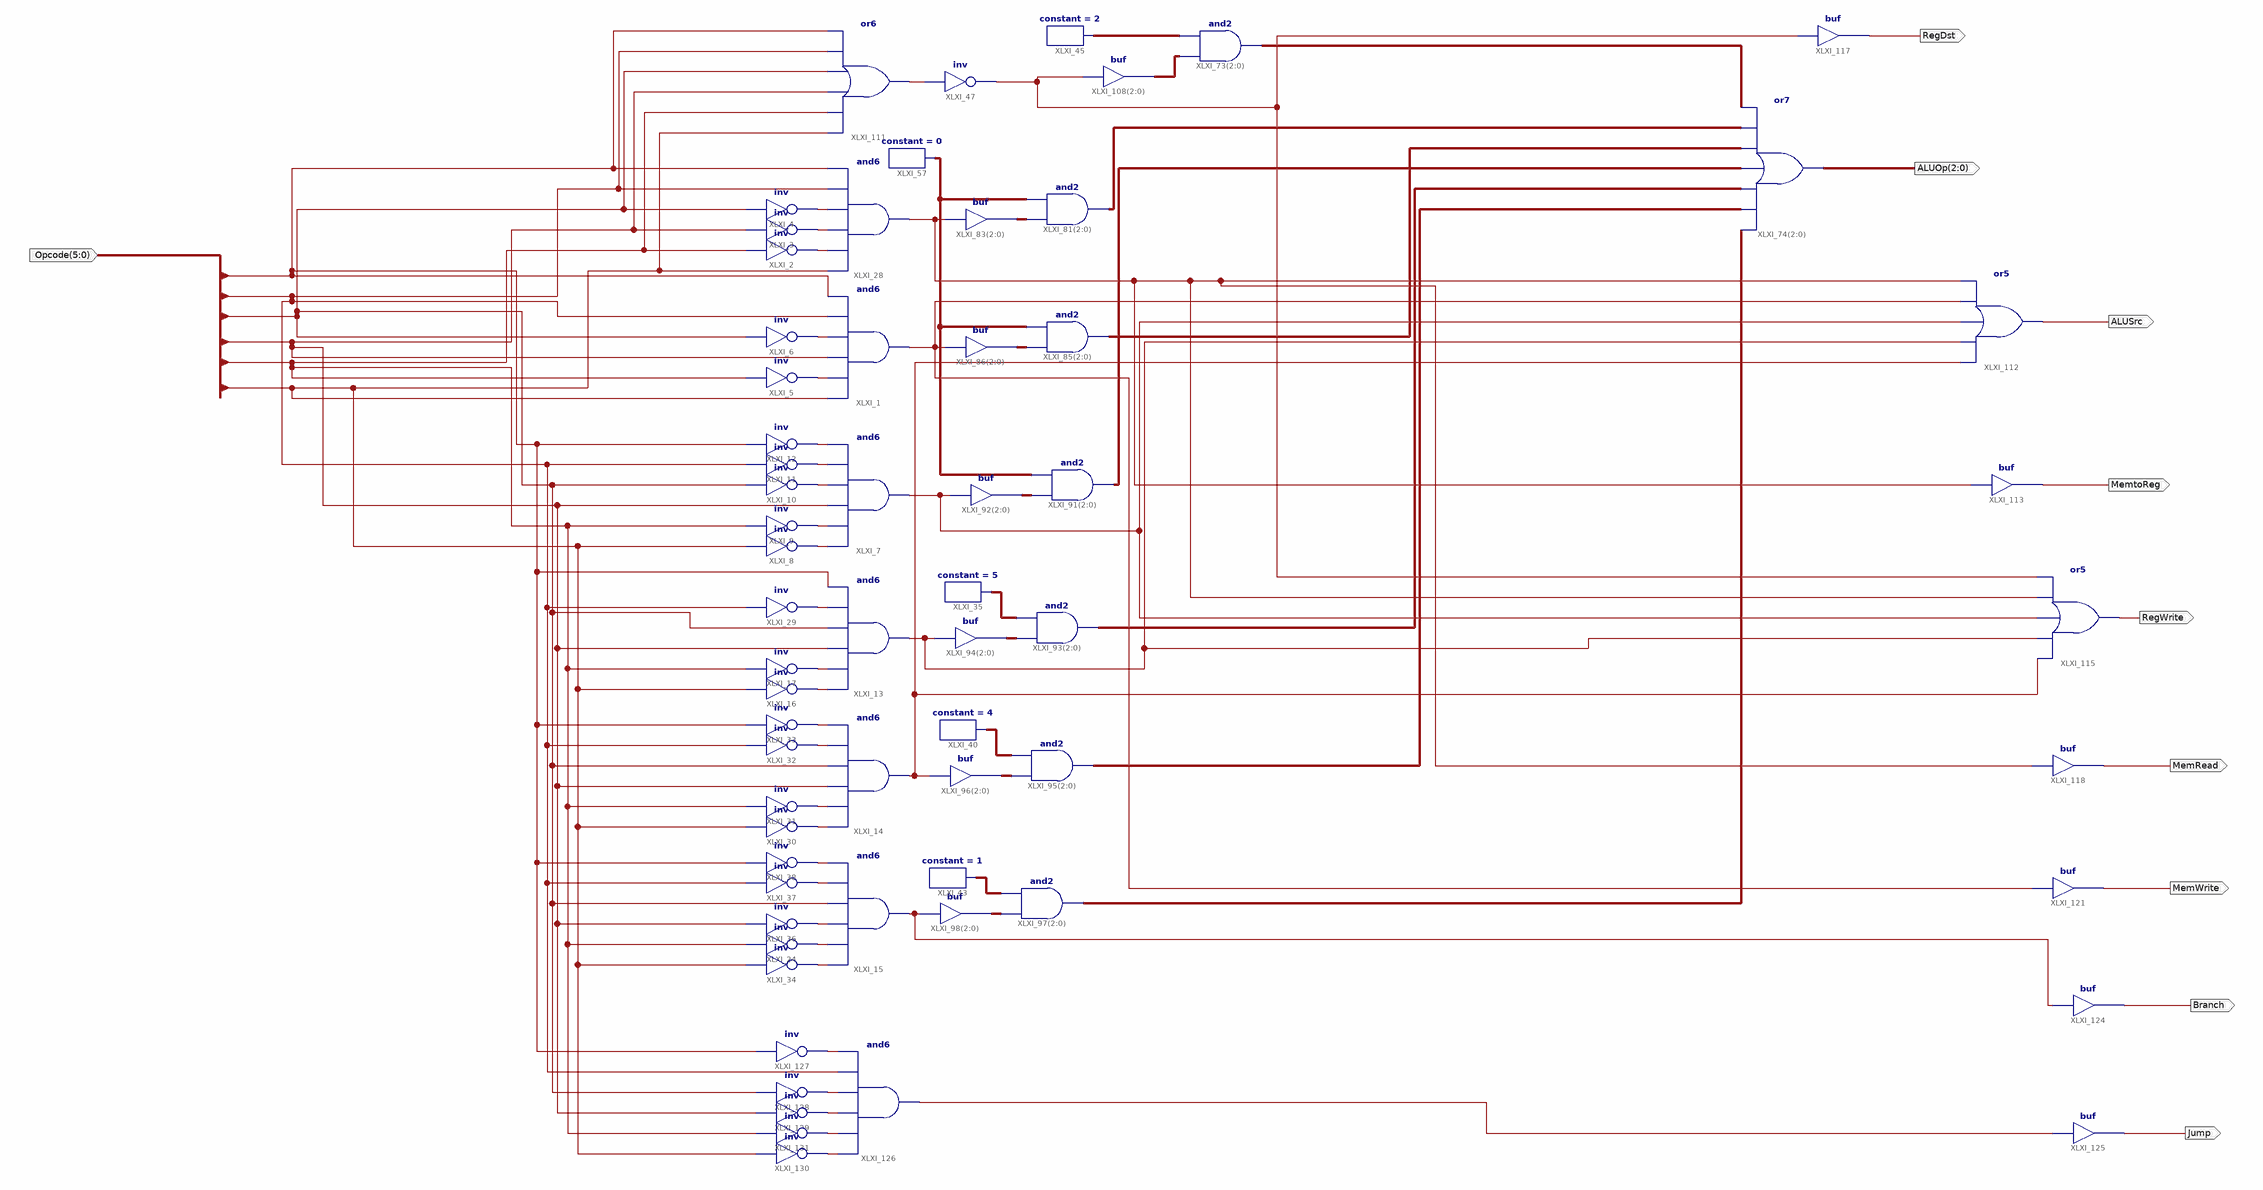
[diagram p0: schematic sheet 1]
// Xilinx ISE schematic control.sch (spartan3) as structural Verilog: 64 symbols, 10 ports
module control (
  input  [5:0] Opcode,
  output [2:0] ALUOp,
  output ALUSrc,
  output MemtoReg,
  output RegWrite,
  output RegDst,
  output MemRead,
  output MemWrite,
  output Branch,
  output Jump
);

  wire XLXN_12, XLXN_13, XLXN_14, XLXN_15, XLXN_16, XLXN_17, XLXN_18, XLXN_19, XLXN_20, XLXN_21, XLXN_22,
       XLXN_23, XLXN_24, XLXN_25, XLXN_26, XLXN_27, XLXN_28, XLXN_29, XLXN_30, XLXN_31, XLXN_32, XLXN_35,
       XLXN_36, XLXN_105, XLXN_110, XLXN_155, XLXN_161, XLXN_163, XLXN_170, XLXN_176, XLXN_180, XLXN_181,
       XLXN_182, XLXN_183, XLXN_184, XLXN_192;
  wire [2:0] XLXN_89, XLXN_93, XLXN_94, XLXN_96, XLXN_104, XLXN_106, XLXN_107, XLXN_108, XLXN_109, XLXN_111,
       XLXN_112, XLXN_113, XLXN_115, XLXN_116, XLXN_117, XLXN_119, XLXN_120, XLXN_135, XLXN_178;

  and XLXI_1 (XLXN_155, Opcode[5], XLXN_14, Opcode[3], XLXN_15, Opcode[1], Opcode[0]);
  not XLXI_2 (XLXN_13, Opcode[4]);
  not XLXI_3 (XLXN_12, Opcode[3]);
  not XLXI_4 (XLXN_22, Opcode[2]);
  not XLXI_5 (XLXN_14, Opcode[4]);
  not XLXI_6 (XLXN_15, Opcode[2]);
  and XLXI_7 (XLXN_105, XLXN_16, XLXN_17, Opcode[3], XLXN_18, XLXN_19, XLXN_20);
  not XLXI_8 (XLXN_16, Opcode[5]);
  not XLXI_9 (XLXN_17, Opcode[4]);
  not XLXI_10 (XLXN_18, Opcode[2]);
  not XLXI_11 (XLXN_19, Opcode[1]);
  not XLXI_12 (XLXN_20, Opcode[0]);
  and XLXI_13 (XLXN_110, XLXN_21, XLXN_24, Opcode[3], Opcode[2], XLXN_23, Opcode[0]);
  and XLXI_14 (XLXN_170, XLXN_26, XLXN_25, Opcode[3], Opcode[2], XLXN_28, XLXN_27);
  and XLXI_15 (XLXN_176, XLXN_30, XLXN_29, XLXN_32, Opcode[2], XLXN_31, XLXN_36);
  not XLXI_16 (XLXN_21, Opcode[5]);
  not XLXI_17 (XLXN_24, Opcode[4]);
  not XLXI_29 (XLXN_23, Opcode[1]);
  not XLXI_30 (XLXN_26, Opcode[5]);
  not XLXI_31 (XLXN_25, Opcode[4]);
  not XLXI_32 (XLXN_28, Opcode[1]);
  not XLXI_33 (XLXN_27, Opcode[0]);
  not XLXI_34 (XLXN_30, Opcode[5]);
  not XLXI_24 (XLXN_29, Opcode[4]);
  not XLXI_36 (XLXN_32, Opcode[3]);
  not XLXI_37 (XLXN_31, Opcode[1]);
  not XLXI_38 (XLXN_36, Opcode[0]);
  and XLXI_28 (XLXN_163, Opcode[5], XLXN_13, XLXN_12, XLXN_22, Opcode[1], Opcode[0]);
  assign XLXN_106 = XLXN_94 & XLXN_178;  // and2 XLXI_81[2..0], 3 bits wide
  assign XLXN_94 = {3{XLXN_163}};  // buf XLXI_83[2..0], 3 bits wide
  assign XLXN_107 = XLXN_96 & XLXN_178;  // and2 XLXI_85[2..0], 3 bits wide
  assign XLXN_96 = {3{XLXN_155}};  // buf XLXI_86[2..0], 3 bits wide
  assign XLXN_108 = XLXN_104 & XLXN_178;  // and2 XLXI_91[2..0], 3 bits wide
  assign XLXN_104 = {3{XLXN_105}};  // buf XLXI_92[2..0], 3 bits wide
  constant #(.CValue("5")) XLXI_35 (.O(XLXN_111));
  assign XLXN_112 = XLXN_109 & XLXN_111;  // and2 XLXI_93[2..0], 3 bits wide
  assign XLXN_109 = {3{XLXN_110}};  // buf XLXI_94[2..0], 3 bits wide
  assign XLXN_116 = XLXN_113 & XLXN_115;  // and2 XLXI_95[2..0], 3 bits wide
  assign XLXN_113 = {3{XLXN_170}};  // buf XLXI_96[2..0], 3 bits wide
  constant #(.CValue("4")) XLXI_40 (.O(XLXN_115));
  assign XLXN_119 = XLXN_117 & XLXN_120;  // and2 XLXI_97[2..0], 3 bits wide
  assign XLXN_117 = {3{XLXN_176}};  // buf XLXI_98[2..0], 3 bits wide
  constant #(.CValue("1")) XLXI_43 (.O(XLXN_120));
  assign ALUOp = XLXN_119 | XLXN_116 | XLXN_112 | XLXN_108 | XLXN_107 | XLXN_106 | XLXN_93;  // or7 XLXI_74[2..0], 3 bits wide
  constant #(.CValue("2")) XLXI_45 (.O(XLXN_89));
  assign XLXN_93 = XLXN_135 & XLXN_89;  // and2 XLXI_73[2..0], 3 bits wide
  not XLXI_47 (XLXN_161, XLXN_35);
  assign XLXN_135 = {3{XLXN_161}};  // buf XLXI_108[2..0], 3 bits wide
  or XLXI_111 (XLXN_35, Opcode[5], Opcode[4], Opcode[3], Opcode[2], Opcode[1], Opcode[0]);
  or XLXI_112 (ALUSrc, XLXN_170, XLXN_110, XLXN_105, XLXN_155, XLXN_163);
  buf XLXI_113 (MemtoReg, XLXN_163);
  buf XLXI_117 (RegDst, XLXN_161);
  or XLXI_115 (RegWrite, XLXN_170, XLXN_110, XLXN_105, XLXN_163, XLXN_161);
  buf XLXI_118 (MemRead, XLXN_163);
  buf XLXI_121 (MemWrite, XLXN_155);
  buf XLXI_124 (Branch, XLXN_176);
  constant #(.CValue("0")) XLXI_57 (.O(XLXN_178));
  buf XLXI_125 (Jump, XLXN_192);
  and XLXI_126 (XLXN_192, XLXN_183, XLXN_184, XLXN_182, XLXN_181, Opcode[1], XLXN_180);
  not XLXI_127 (XLXN_180, Opcode[0]);
  not XLXI_128 (XLXN_181, Opcode[2]);
  not XLXI_129 (XLXN_182, Opcode[3]);
  not XLXI_130 (XLXN_183, Opcode[5]);
  not XLXI_131 (XLXN_184, Opcode[4]);
endmodule
